# EAGLE schematic TJ Gen1 Prototype (EAGLE 7.1.0)
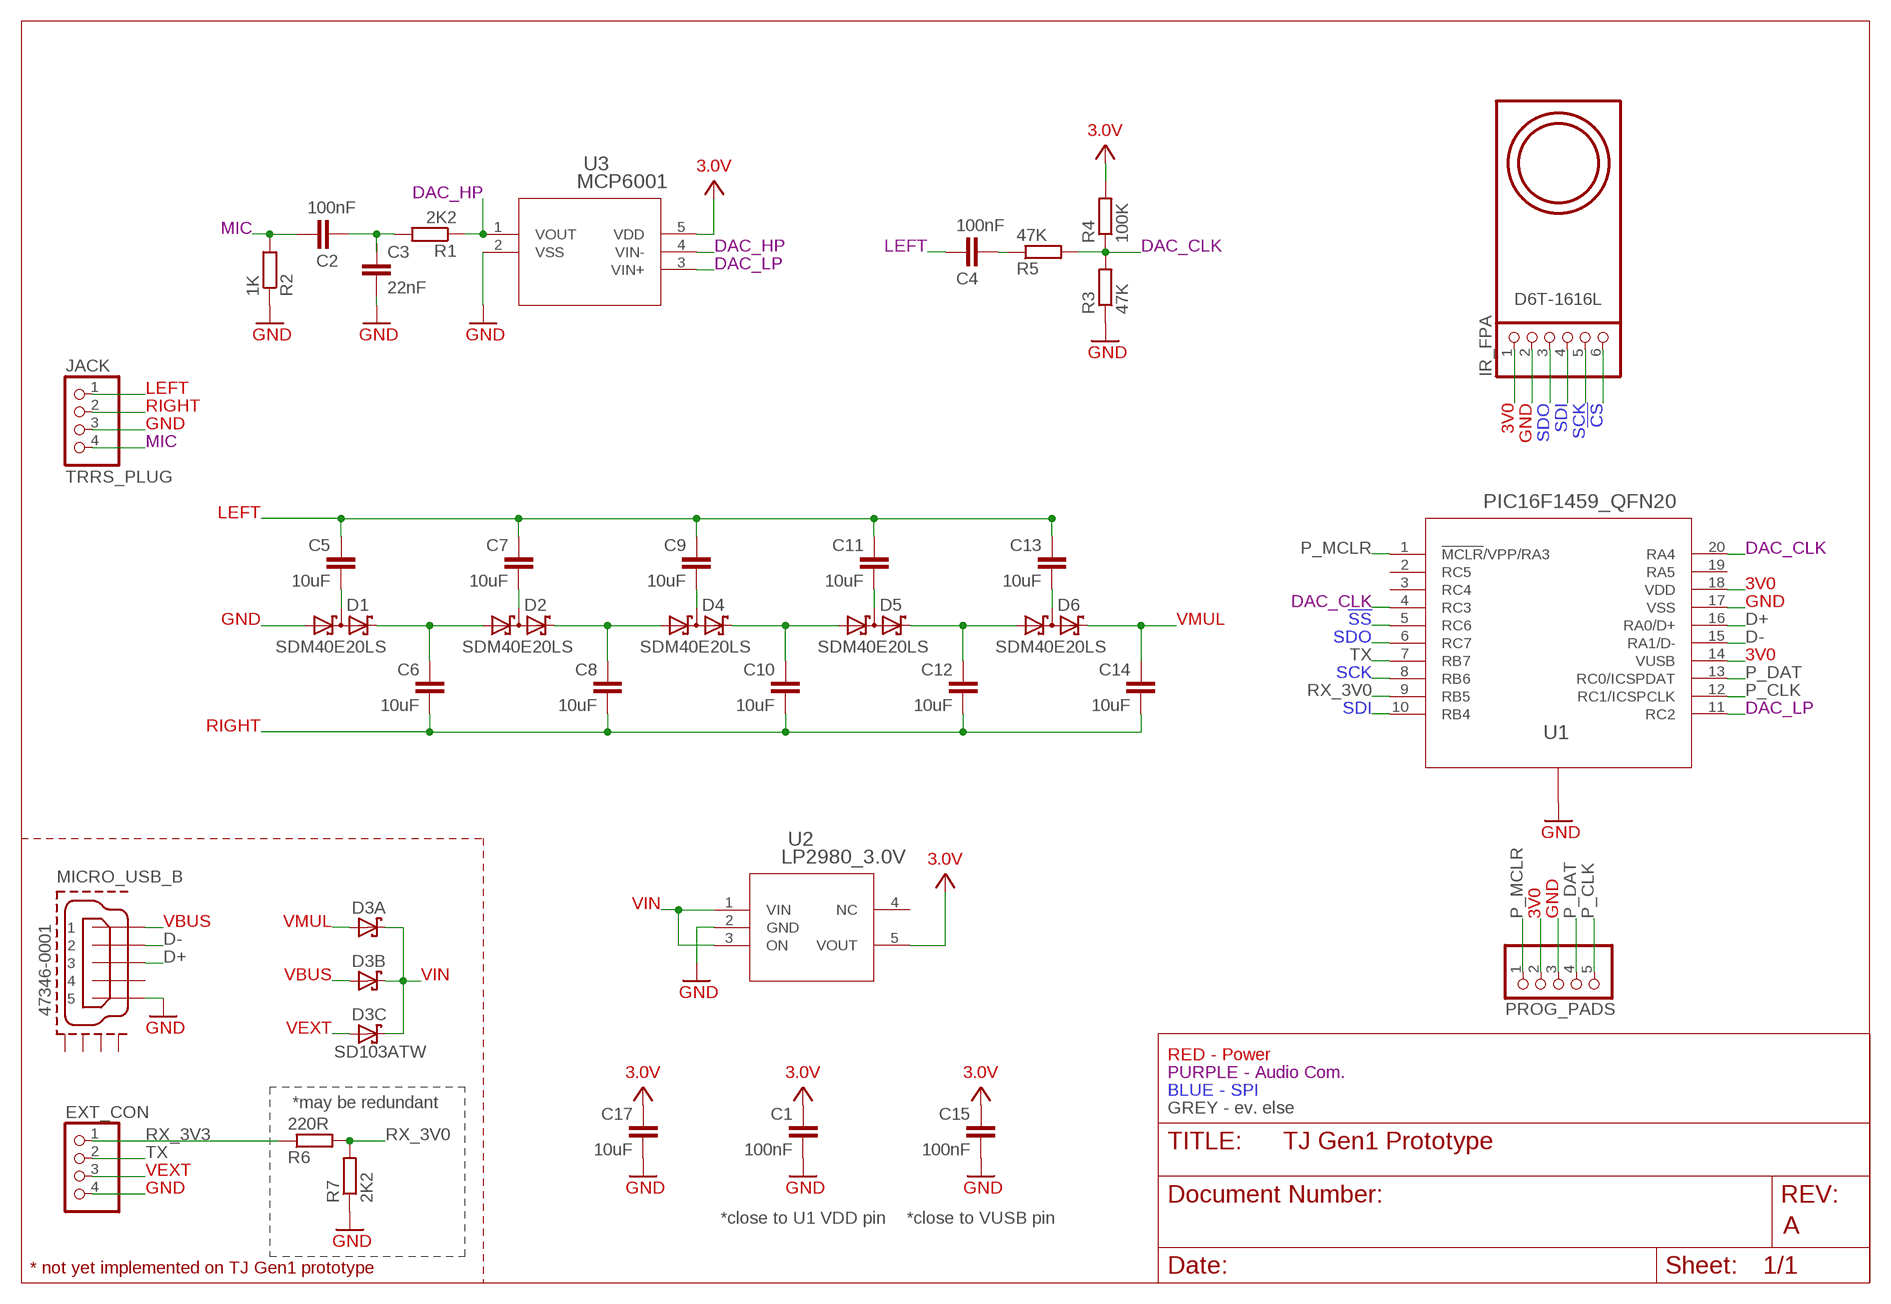
[diagram p0: schematic, sheet 1]

## Parts
C1  100nF  C-EUC0603  [C0603]
C2  100nF  C-EUC0603  [C0603]
C3  22nF  C-EUC0603  [C0603]
C4  100nF  C-EUC0603  [C0603]
C5  10uF  C-EUC0603  [C0603]
C6  10uF  C-EUC0603  [C0603]
C7  10uF  C-EUC0603  [C0603]
C8  10uF  C-EUC0603  [C0603]
C9  10uF  C-EUC0603  [C0603]
C10  10uF  C-EUC0603  [C0603]
C11  10uF  C-EUC0603  [C0603]
C12  10uF  C-EUC0603  [C0603]
C13  10uF  C-EUC0603  [C0603]
C14  10uF  C-EUC0603  [C0603]
C15  100nF  C-EUC0603  [C0603]
C17  10uF  C-EUC0603  [C0603]
D1  SDM40E20LS  BAS40-04  [SOT23]
D2  SDM40E20LS  BAS40-04  [SOT23]
D3  SD103ATW  BAS70VV  [SOT666]
D4  SDM40E20LS  BAS40-04  [SOT23]
D5  SDM40E20LS  BAS40-04  [SOT23]
D6  SDM40E20LS  BAS40-04  [SOT23]
EXT_CON  PINHD-1X4  [1X04]
IR_FPA  D6T-1616L  PINHD-1X6  [1X06]
JACK  TRRS_PLUG  PINHD-1X4  [1X04]
MICRO_USB_B  47346-0001  MOLEX-47346-0001  [MOLEX-47364-0001]
PROG_PADS  PINHD-1X5  [1X05]
R1  2K2  R-EU_R0603  [R0603]
R2  1K  R-EU_R0603  [R0603]
R3  47K  R-EU_R0603  [R0603]
R4  100K  R-EU_R0603  [R0603]
R5  47K  R-EU_R0603  [R0603]
R6  220R  R-EU_R0603  [R0603]
R7  2K2  R-EU_R0603  [R0603]
U1  PIC16F1459_QFN20  PIC16F1459-X_ML  [QFN20_4X4MC]
U2  LP2980_3.0V  LP2980_DBV_5  [MF05A]
U3  MCP6001  MCP6001-X/LT  [SC70-5_MC]

## Nets
3V0: IR_FPA.1 PROG_PADS.2 U1.14(VUSB) U1.18(VDD)
!CS: IR_FPA.6
!SS: U1.5(RC6)
+3V3: C1.1 C15.1 C17.1 R4.2 U2.5(VOUT) U3.5(VDD) ; supply symbol labelled 3.0V
D+: MICRO_USB_B.3 U1.16(RA0/D+)
D-: MICRO_USB_B.2 U1.15(RA1/D-)
DAC_CLK: R3.2 R4.1 R5.2 U1.4(RC3) U1.20(RA4)
DAC_HP: R1.1 U3.1(VOUT) U3.4(VIN-)
DAC_LP: U1.11(RC2) U3.3(VIN+)
GND: C1.2 C3.2 C15.2 C17.2 D1.1(A1) EXT_CON.4 IR_FPA.2 JACK.3 MICRO_USB_B.5 PROG_PADS.3 R2.1 R3.1 R7.1 U1.17(VSS) U1.21(EP) U2.2(GND) U3.2(VSS)
LEFT: C4.1 C5.1 C7.1 C9.1 C11.1 C13.1 JACK.1
MIC: C2.1 JACK.4 R2.2
N$1: C9.2 D4.3(C1A2)
N$2: C5.2 D1.3(C1A2)
N$3: C2.2 C3.1 R1.2
N$4: C4.2 R5.1
N$5: C7.2 D2.3(C1A2)
N$6: C6.1 D1.2(C2) D2.1(A1)
N$9: C8.1 D2.2(C2) D4.1(A1)
N$11: C10.1 D4.2(C2) D5.1(A1)
N$12: C11.2 D5.3(C1A2)
N$13: C12.1 D5.2(C2) D6.1(A1)
N$16: C13.2 D6.3(C1A2)
P_CLK: PROG_PADS.5 U1.12(RC1/ICSPCLK)
P_DAT: PROG_PADS.4 U1.13(RC0/ICSPDAT)
P_MCLR: PROG_PADS.1 U1.1(!MCLR!/VPP/RA3)
RIGHT: C6.2 C8.2 C10.2 C12.2 C14.2 JACK.2
RX_3V0: R6.2 R7.2 U1.9(RB5)
RX_3V3: EXT_CON.1 R6.1
SCK: IR_FPA.5 U1.8(RB6)
SDI: IR_FPA.4 U1.10(RB4)
SDO: IR_FPA.3 U1.6(RC7)
TX: EXT_CON.2 U1.7(RB7)
VBUS: D3.2(B:A) MICRO_USB_B.1
VEXT: D3.3(C:A) EXT_CON.3
VIN: D3.4(C:C) D3.5(B:C) D3.6(A:C) U2.1(VIN) U2.3(ON)
VMUL: C14.1 D3.1(A:A) D6.2(C2)
Unconnected: MICRO_USB_B.4 MICRO_USB_B.GND1 MICRO_USB_B.GND2 MICRO_USB_B.GND3 MICRO_USB_B.GND4 U1.2(RC5) U1.3(RC4) U1.19(RA5) U2.4(NC)

## Notes on the sheet
- RED - Power
- PURPLE - Audio Com.
- *may be redundant | BLUE - SPI
- GREY - ev. else
- *close to U1 VDD pin | *close to VUSB pin
- A
- * not yet implemented on TJ Gen1 prototype

## Library data of the parts
C1-C15 C17 = rcl:C-EU: CAPACITOR, European symbol
D1 D2 D4-D6 = diode:BAS40-04: Silicon Schottky Diodes General-purpose diode for high-speed switching
D3 = diode:BAS70VV: Silicon Schottky Diodes General-purpose diode for high-speed switching Source: BAS70_1PS7XSB70_SER_8.pdf
EXT_CON JACK = pinhead:PINHD-1X4: PIN HEADER
IR_FPA = pinhead:PINHD-1X6: PIN HEADER
MICRO_USB_B = usb_con-update:MOLEX-47346-0001: MICRO USB B, BOTTOM MOUNT
PROG_PADS = pinhead:PINHD-1X5: PIN HEADER
R1-R7 = rcl:R-EU_: RESISTOR, European symbol
U1 = microchip_pic16lf1459:PIC16F1459-X_ML
U2 = ti_lp2980:LP2980_DBV_5; BASE_PN: LP2980; COMP: TypeLDO; LIBRARY: ReferenceLP2980AIM5; PARTNUMBER: LP2980AIM5-25; PIN: Count5; SYMBOL: NameLP2980AIM5-25; TYPE: LP2980AIM5-2.5; VENDOR: NationalSemiconductor; VERSION: 1
U3 = microchip_mcp6001:MCP6001-X/LT